# EAGLE design openysy (EAGLE 7.4.0)
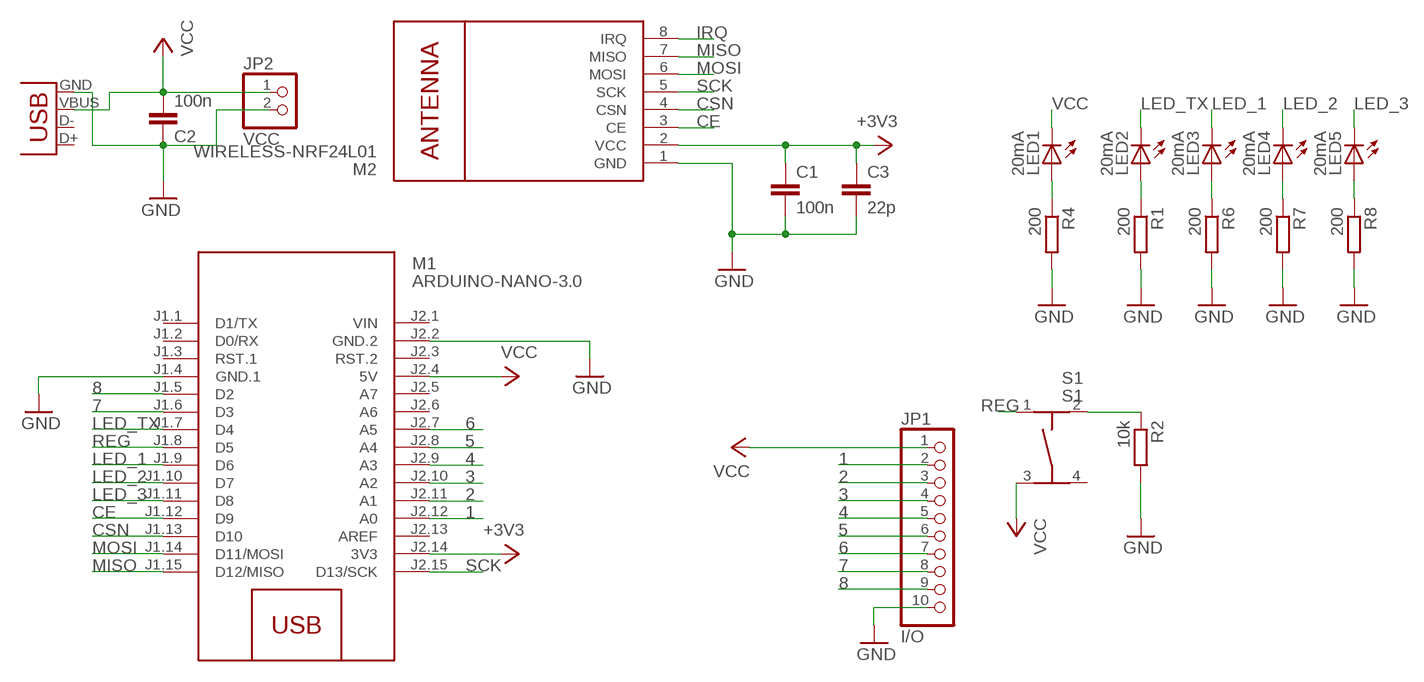
[diagram p0: schematic, sheet 1]

## Parts
C1  100n  C-EUC1206  [C1206]
C2  100n  C-EUC1206  [C1206]
C3  22p  C-EUC1206  [C1206]
JP1  I/O  PINHD-1X10  [1X10]
JP2  VCC  PINHD-1X2  [1X02]
LED1  20mA  LEDCHIPLED_1206  [CHIPLED_1206]
LED2  20mA  LEDCHIPLED_1206  [CHIPLED_1206]
LED3  20mA  LEDCHIPLED_1206  [CHIPLED_1206]
LED4  20mA  LEDCHIPLED_1206  [CHIPLED_1206]
LED5  20mA  LEDCHIPLED_1206  [CHIPLED_1206]
M1  ARDUINO-NANO-3.0  [ARDUINO-NANO-3.0]
M2  WIRELESS-NRF24L01  [WIRELESS-NRF24L01]
R1  200  R-EU_R1206  [R1206]
R2  10k  R-EU_R1206  [R1206]
R4  200  R-EU_R1206  [R1206]
R6  200  R-EU_R1206  [R1206]
R7  200  R-EU_R1206  [R1206]
R8  200  R-EU_R1206  [R1206]
S1  S1  TASTER-9314_SMD  [TASTER-9314_SMD]
X2  USBPTH  [USB-B-PTH]

## Nets
1: JP1.2 M1.J2.12(A0)
2: JP1.3 M1.J2.11(A1)
3: JP1.4 M1.J2.10(A2)
4: JP1.5 M1.J2.9(A3)
5: JP1.6 M1.J2.8(A4)
6: JP1.7 M1.J2.7(A5)
7: JP1.8 M1.J1.6(D3)
8: JP1.9 M1.J1.5(D2)
+3V3: C1.1 C3.1 M1.J2.14(3V3) M2.2(VCC)
CE: M1.J1.12(D9) M2.3(CE)
CSN: M1.J1.13(D10) M2.4(CSN)
GND: C1.2 C2.1 C3.2 JP1.10 JP2.2 M1.J1.4(GND.1) M1.J2.2(GND.2) M2.1(GND) R1.2 R2.2 R4.2 R6.2 R7.2 R8.2 X2.GND
IRQ: M2.8(IRQ)
LED_1: LED3.C M1.J1.9(D6)
LED_2: LED4.C M1.J1.10(D7)
LED_3: LED5.C M1.J1.11(D8)
LED_TX: LED2.C M1.J1.7(D4)
MISO: M1.J1.15(D12/MISO) M2.7(MISO)
MOSI: M1.J1.14(D11/MOSI) M2.6(MOSI)
N$1: LED2.A R1.1
N$2: LED1.A R4.1
N$4: R2.1 S1.2
N$5: LED3.A R6.1
N$6: LED4.A R7.1
N$7: LED5.A R8.1
REG: M1.J1.8(D5) S1.1
SCK: M1.J2.15(D13/SCK) M2.5(SCK)
VCC: C2.2 JP1.1 JP2.1 LED1.C M1.J2.4(5V) S1.3 X2.VBUS
Unconnected: M1.J1.1(D1/TX) M1.J1.2(D0/RX) M1.J1.3(RST.1) M1.J2.3(RST.2) M1.J2.5(A7) M1.J2.6(A6) M1.J2.13(AREF) S1.4 X2.D+ X2.D-

## Power pins joined to a net without a drawn wire
VIN: M1.J2.1(VIN)

## Library data of the parts
C1-C3 = rcl:C-EU: CAPACITOR, European symbol
JP1 = pinhead:PINHD-1X10: PIN HEADER
JP2 = pinhead:PINHD-1X2: PIN HEADER
LED1-LED5 = led:LED: LED OSRAM: - CHIPLED LG R971, LG N971, LY N971, LG Q971, LY Q971, LO R971, LY R971 LH N974, LH R974 LS Q976, LO Q976, LY Q976 LO Q996 - Hyper CHIPLED LW Q18S LB Q993, LB Q99A, LB R99A - SideLED LS A670, LO A670, LY A670, LG A670, LP A670 LB A673, LV A673, LT A673, LW A673 LH A674 LY A675 LS A676, LA A676, LO A676, LY A676, LW A676 LS A679, LY A679, LG A679 - Hyper Micro SIDELED® LS Y876, LA Y876, LO Y876, LY Y876 LT Y87S - SmartLED LW L88C, LW L88S LB L89C, LB L89S, LG L890 LS L89K, LO L89K, LY L89K LS L896, LA L896, LO L896, LY L896 - TOPLED LS T670, LO T670, LY T670, LG T670, LP T670 LSG T670, LSP T670, LSY T670, LOP T670, LYG T670 LG T671, LOG T671, LSG T671 LB T673, LV T673, LT T673, LW T673 LH T674 LS T676, LA T676, LO T676, LY T676, LB T676, LH T676, LSB T676, LW T676 LB T67C, LV T67C, LT T67C, LS T67K, LO T67K, LY T67K, LW E67C LS E67B, LA E67B, LO E67B, LY E67B, LB E67C, LV E67C, LT E67C LW T67C LS T679, LY T679, LG T679 LS T770, LO T770, LY T770, LG T770, LP T770 LB T773, LV T773, LT T773, LW T773 LH T774 LS E675, LA E675, LY E675, LS T675 LS T776, LA T776, LO T776, LY T776, LB T776 LHGB T686 LT T68C, LB T68C - Hyper Mini TOPLED® LB M676 - Mini TOPLED Santana® LG M470 LS M47K, LO M47K, LY M47K Source: http://www.osram.convergy.de LUXEON: - LUMILED® LXK2-PW12-R00, LXK2-PW12-S00, LXK2-PW14-U00, LXK2-PW14-V00 LXK2-PM12-R00, LXK2-PM12-S00, LXK2-PM14-U00 LXK2-PE12-Q00, LXK2-PE12-R00, LXK2-PE12-S00, LXK2-PE14-T00, LXK2-PE14-U00 LXK2-PB12-K00, LXK2-PB12-L00, LXK2-PB12-M00, LXK2-PB14-N00, LXK2-PB14-P00, LXK2-PB14-Q00 LXK2-PR12-L00, LXK2-PR12-M00, LXK2-PR14-Q00, LXK2-PR14-R00 LXK2-PD12-Q00, LXK2-PD12-R00, LXK2-PD12-S00 LXK2-PH12-R00, LXK2-PH12-S00 LXK2-PL12-P00, LXK2-PL12-Q00, LXK2-PL12-R00 Source: www.luxeon.com KINGBRIGHT: KA-3528ASYC Source: www.kingbright.com
M1 = diy-modules:ARDUINO-NANO-3.0: Arduino Nano 3.0
M2 = diy-modules:WIRELESS-NRF24L01: 2.4 GHz Wireless Module based on NRF24L01 chip
R1 R2 R4 R6-R8 = rcl:R-EU_: RESISTOR, European symbol
S1 = Ergaenzung:TASTER-9314_SMD
X2 = usb:USB: USB Connectors USB-B-PTH is fully proven SKU : PRT-00139 USB-miniB is fully proven SKU : PRT-00587 USB-A-PCB is untested. USB-A-H is throughly reviewed, but untested. Spark Fun Electronics SKU : PRT-00437 USB-B-SMT is throughly reviewed, but untested. Needs silkscreen touching up. USB-A-S has not been used/tested USB-MB-H has not been used/tested

## Net classes
0 default: clearance 0.305 mm

## Board
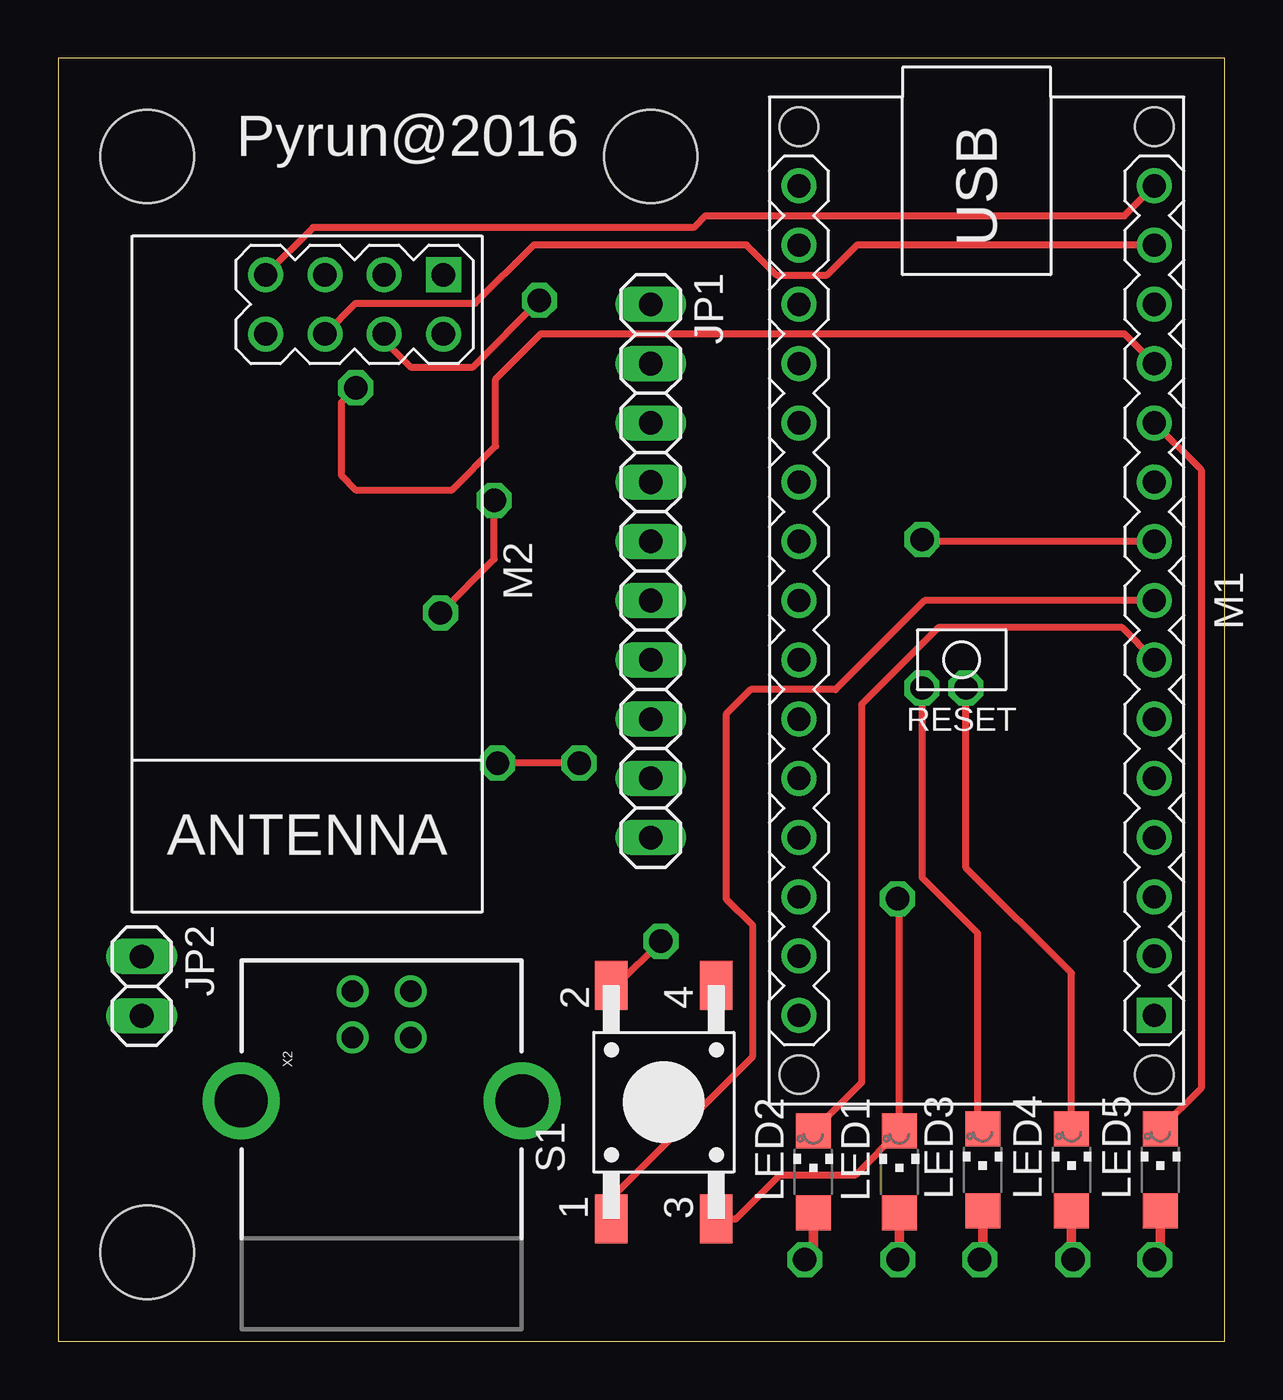
[diagram p1: board, top side]
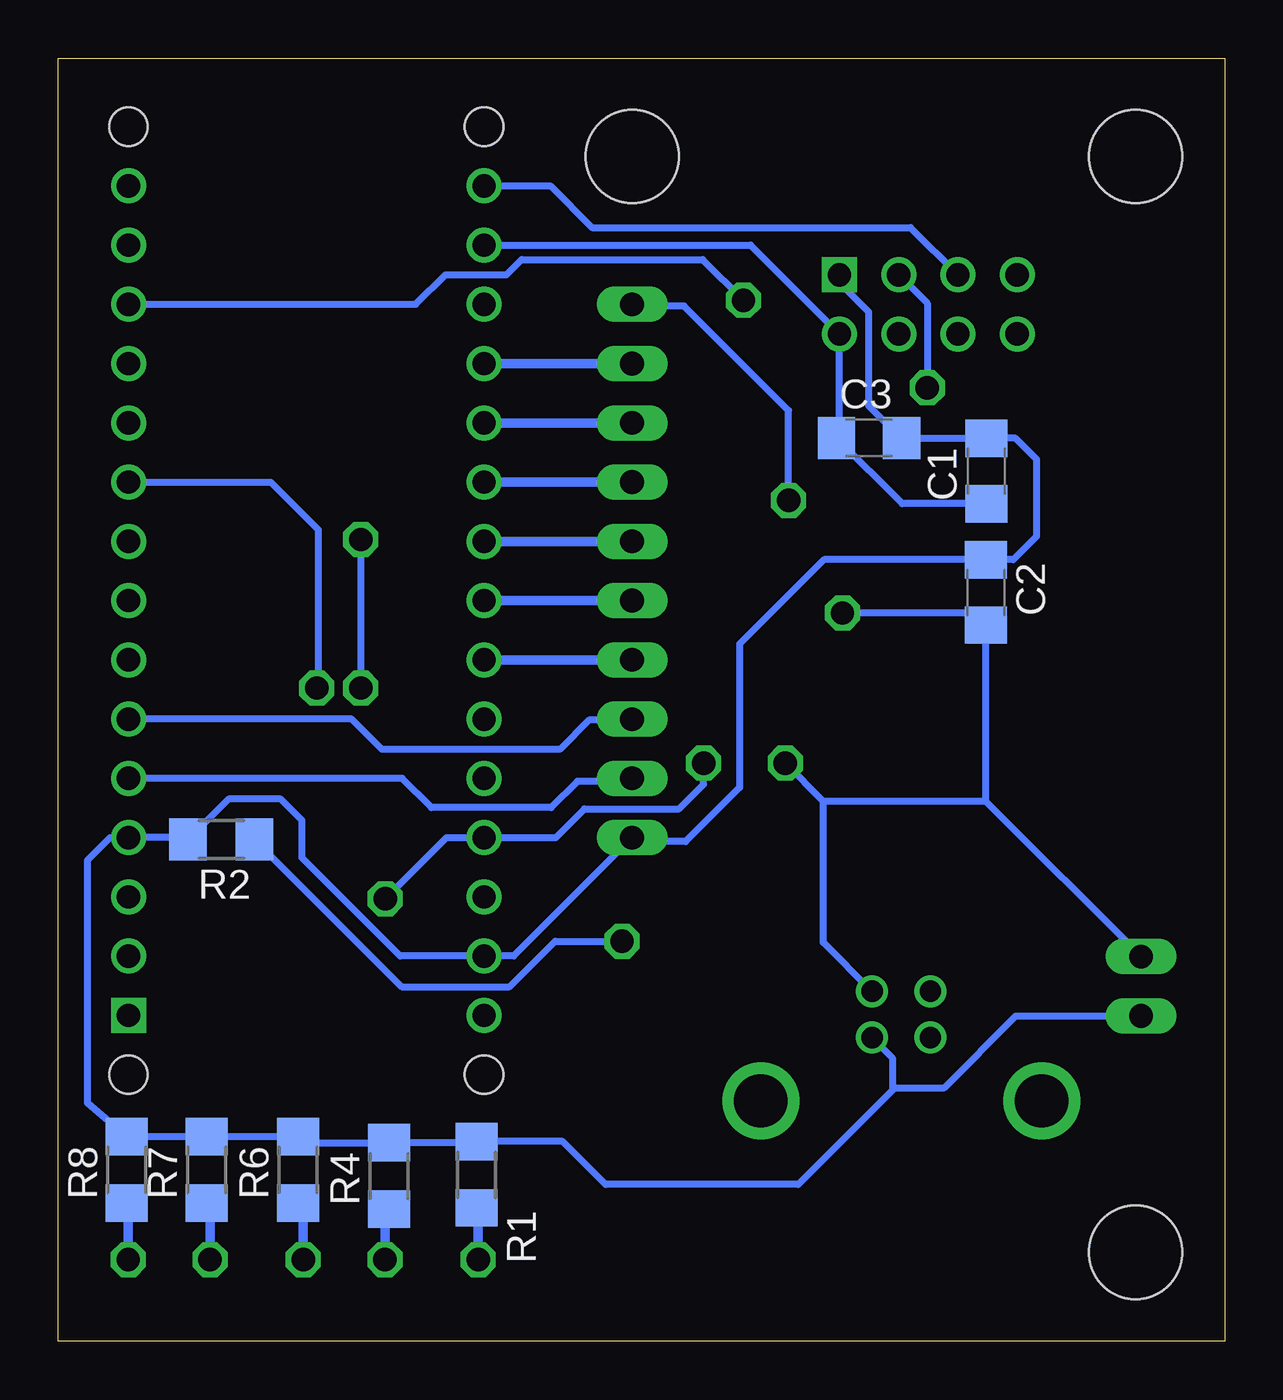
[diagram p2: board, bottom side, seen from below]

Size 50 x 55 mm. Coordinates in mm from the lower left corner, seen from the top.
Outline: 0,0 50,0 50,55 0,55 0,0
Copper layers (1*16): Top 0.035mm / dielectric 1.6mm / Bottom 0.035mm
Design rules "Elecrow_2-layer_PCB_eagle_rule": minimum track width 6mil, minimum drill 12mil, track to track 6mil, track to pad 6mil, pad to pad 6mil, via to via 8mil, smd to smd 0mil, copper to edge 20mil, drill to drill 10mil, minimum pad ring 6mil, minimum via ring 6mil, stop-mask expansion 0mil, vias tented up to drill 100mil, thermal gap 10mil
Holes 4 mm at 25.4,50.8 3.81,50.8 3.81,3.81

### Footprints (pad centres in the part's own frame; a part is rotated, then mirrored left to right if it is on the bottom)
C1206 = smd 1.6 x 1.8: 1 -1.4,0; 2 1.4,0
1X10 = drill 1.016 long: 1 -11.43,0; 2 -8.89,0; 3 -6.35,0; 4 -3.81,0; 5 -1.27,0; 6 1.27,0; 7 3.81,0; 8 6.35,0; 9 8.89,0; 10 11.43,0
1X02 = drill 1.016 long: 1 -1.27,0; 2 1.27,0
CHIPLED_1206 = smd 1.5 x 1.5: A 0,-1.75; C 0,1.75
ARDUINO-NANO-3.0 = drill 1 square: J1.1 17.78,7.62 | drill 1: J1.2 15.24,7.62; J1.3 12.7,7.62; J1.4 10.16,7.62; J1.5 7.62,7.62; J1.6 5.08,7.62; J1.7 2.54,7.62; J1.8 0,7.62; J1.9 -2.54,7.62; J1.10 -5.08,7.62; J1.11 -7.62,7.62; J1.12 -10.16,7.62; J1.13 -12.7,7.62; J1.14 -15.24,7.62; J1.15 -17.78,7.62; J2.1 17.78,-7.62; J2.2 15.24,-7.62; J2.3 12.7,-7.62; J2.4 10.16,-7.62; J2.5 7.62,-7.62; J2.6 5.08,-7.62; J2.7 2.54,-7.62; J2.8 0,-7.62; J2.9 -2.54,-7.62; J2.10 -5.08,-7.62; J2.11 -7.62,-7.62; J2.12 -10.16,-7.62; J2.13 -12.7,-7.62; J2.14 -15.24,-7.62; J2.15 -17.78,-7.62 | hole 1.651: -20.32,7.62; -20.32,-7.62; 20.32,-7.62; 20.32,7.62
WIRELESS-NRF24L01 = drill 1 square: 1 -12.7,6.35 | drill 1: 2 -10.16,6.35; 3 -12.7,3.81; 4 -10.16,3.81; 5 -12.7,1.27; 6 -10.16,1.27; 7 -12.7,-1.27; 8 -10.16,-1.27
R1206 = smd 1.6 x 1.803: 1 -1.422,0; 2 1.422,0
TASTER-9314_SMD = smd 2.1 x 1.4: 1 -5,2.25; 2 5,2.25; 3 -5,-2.25; 4 5,-2.25
USB-B-PTH = drill 0.914: D+ 0,1.25; D- 1.981,1.25; GND 0,-1.25; VBUS 1.981,-1.25 | drill 2.286: P$1 -2.718,-6.02; P$2 -2.718,6.02

### Placement (x,y rotation side)
C1  10.21,37.3 90 bottom
C2  10.23,32.1 270 bottom
C3  15.24,38.73 0 bottom
JP1  25.4,33.02 270 top
JP2  3.58,15.22 270 top
LED1  36.06,7.26 0 top
LED2  32.37,7.26 0 top
LED3  39.63,7.35 0 top
LED4  43.44,7.35 0 top
LED5  47.25,7.35 0 top
M1  39.37,31.75 270 top
M2  10.16,33.02 270 top
R1  32.06,7.14 90 bottom
R2  43.02,21.5 180 bottom
R4  35.82,7.09 90 bottom
R6  39.72,7.35 90 bottom
R7  43.64,7.35 90 bottom
R8  47.06,7.35 90 bottom
S1  25.96,10.24 90 top
X2  13.86,13.02 90 top

### Tracks (layer width: path | path; a pad name or v marks a point on that pad's centre or on a via)
1
  Bottom 0.406: JP1.2 M1.J2.12
2
  Bottom 0.406: JP1.3 M1.J2.11
3
  Bottom 0.406: M1.J2.10 JP1.4
4
  Bottom 0.406: JP1.5 M1.J2.9
5
  Bottom 0.406: M1.J2.8 JP1.6
6
  Bottom 0.406: JP1.7 M1.J2.7
7
  Bottom 0.305: JP1.8 25.45,26.62 27.25,26.62 28.5,25.38 36.12,25.38 37.42,26.67 M1.J1.6
8
  Bottom 0.305: JP1.9 25.53,24 27.75,24 28.88,22.88 34,22.88 35.26,24.13 M1.J1.5
+3V3
  Bottom 0.305: M1.J2.14 20.32,46.99 M2.2 16.51,38.85 C3.1 13.82,35.91 C1.1
CE  (via drill 1)
  Top 0.305: v12.75,40.88 12.12,40.25 12.12,37.12 12.75,36.5 16.88,36.5 18.75,38.38 18.75,41.25 20.69,43.19 45.71,43.19 M1.J1.12
  Bottom 0.305: M2.3 12.75,44.5 v12.75,40.88
CSN  (via drill 1)
  Top 0.305: v20.62,44.62 17.75,41.75 15.12,41.75 13.97,42.91 M2.4
  Bottom 0.305: M1.J1.13 34.67,44.45 33.41,45.71 30.8,45.71 30.14,46.38 22.38,46.38 v20.62,44.62
GND
  Bottom 0.305: R1.2 32.11,8.51 R4.2 39.46,8.51 R6.2 R7.2 R8.2 48.75,10.21 48.75,20.62 47.78,21.59 M1.J1.4 44.52,21.59 R2.2 42.7,23.24 40.46,23.24 39.55,22.33 39.55,20.72 35.34,16.51 M1.J2.2 30.48,16.51 JP1.10 25.23,21.42 23.1,21.42 20.79,23.73 20.79,29.89 17.18,33.51 C2.1 9.05,33.51 8.05,34.51 8.05,37.8 8.96,38.71 C1.2 13.82,38.7 C3.2 13.88,38.73 15.26,40.11 15.26,44.13 16.51,45.38 M2.1 | JP2.2 3.6,13.93 8.96,13.93 12.04,10.85 14.14,10.85 14.24,10.74 | 31.76,8.26 R1.2 | R1.2 28.37,8.56 26.53,6.72 18.27,6.72 14.24,10.74 | X2.GND 14.24,12.15 14.24,10.74
LED_1  (via drill 1)
  Top 0.305: M1.J1.9 37.11,34.29 v37.03,34.37 | v37.03,28 37.03,19.88 39.41,17.5 39.41,9.32 LED3.C
  Bottom 0.305: v37.03,34.37 v37.03,28
LED_2  (via drill 1)
  Top 0.305: LED4.C 43.44,15.78 38.92,20.3 v38.92,28
  Bottom 0.305: M1.J1.10 40.89,36.83 38.85,34.79 38.85,28.07 v38.92,28
LED_3
  Top 0.305: LED5.C 49,10.85 49,37.36 M1.J1.11
LED_TX
  Top 0.305: M1.J1.7 45.61,30.59 37.73,30.59 34.44,27.3 34.44,11.08 LED2.C
MISO
  Top 0.305: M2.7 10.92,47.75 27.25,47.75 27.75,48.25 45.71,48.25 M1.J1.15
MOSI
  Top 0.305: M1.J1.14 34.24,46.99 32.96,45.71 30.8,45.71 29.51,47 20.38,47 17.88,44.5 12.75,44.5 M2.6
N$1  (via drill 1)
  Top 0.406: LED2.A 32.37,4 v32,3.5
  Bottom 0.406: v32,3.5 32,6.22 R1.1
N$2  (via drill 1)
  Top 0.406: LED1.A 36.06,4 v36,3.5
  Bottom 0.406: v36,3.5 36,6.17 R4.1
N$4  (via drill 1)
  Top 0.305: v25.83,17.15 23.93,15.24 S1.2
  Bottom 0.305: R2.1 35.28,15.19 30.66,15.19 28.7,17.15 v25.83,17.15
N$5  (via drill 1)
  Top 0.406: LED3.A 39.63,3.5 v39.5,3.5
  Bottom 0.406: v39.5,3.5 39.5,5.93 R6.1
N$6  (via drill 1)
  Top 0.406: LED4.A 43.44,3.5 v43.5,3.5
  Bottom 0.406: v43.5,3.5 43.5,5.93 R7.1
N$7  (via drill 1)
  Top 0.406: LED5.A 47.25,3.5 v47,3.5
  Bottom 0.406: v47,3.5 47,5.93 R8.1
REG
  Top 0.305: M1.J1.8 37.14,31.75 33.32,27.93 29.68,27.93 28.63,26.88 28.63,18.97 29.75,17.85 29.75,12.18 23.43,5.86 S1.1
SCK
  Bottom 0.305: M1.J2.15 28.91,49.53 27.12,47.75 13.46,47.75 M2.5
VCC  (via drill 1)
  Top 0.305: v16.38,31.22 18.69,33.53 v18.69,36.05 | v35.98,18.97 36.06,18.89 LED1.C 34.19,7.14 30.94,7.14 29.05,5.25 S1.3 | v22.33,24.78 v18.83,24.78
  Bottom 0.305: JP2.1 10.23,23.15 | 10.23,23.15 C2.2 10.47,31.22 v16.38,31.22 | v18.69,36.05 18.69,39.9 23.17,44.38 25.33,44.38 JP1.1 | v35.98,18.97 33.36,21.59 M1.J2.4 28.67,21.59 27.44,22.82 23.38,22.82 22.33,23.87 v22.33,24.78 | 10.23,23.15 15.61,23.15 | 15.61,23.15 17.2,23.15 | 15.6,23.14 15.61,23.15 | 17.2,23.15 v18.83,24.78 | X2.VBUS 17.2,17.09 17.2,23.15

### Text on the board
tNames: Pyrun@2016